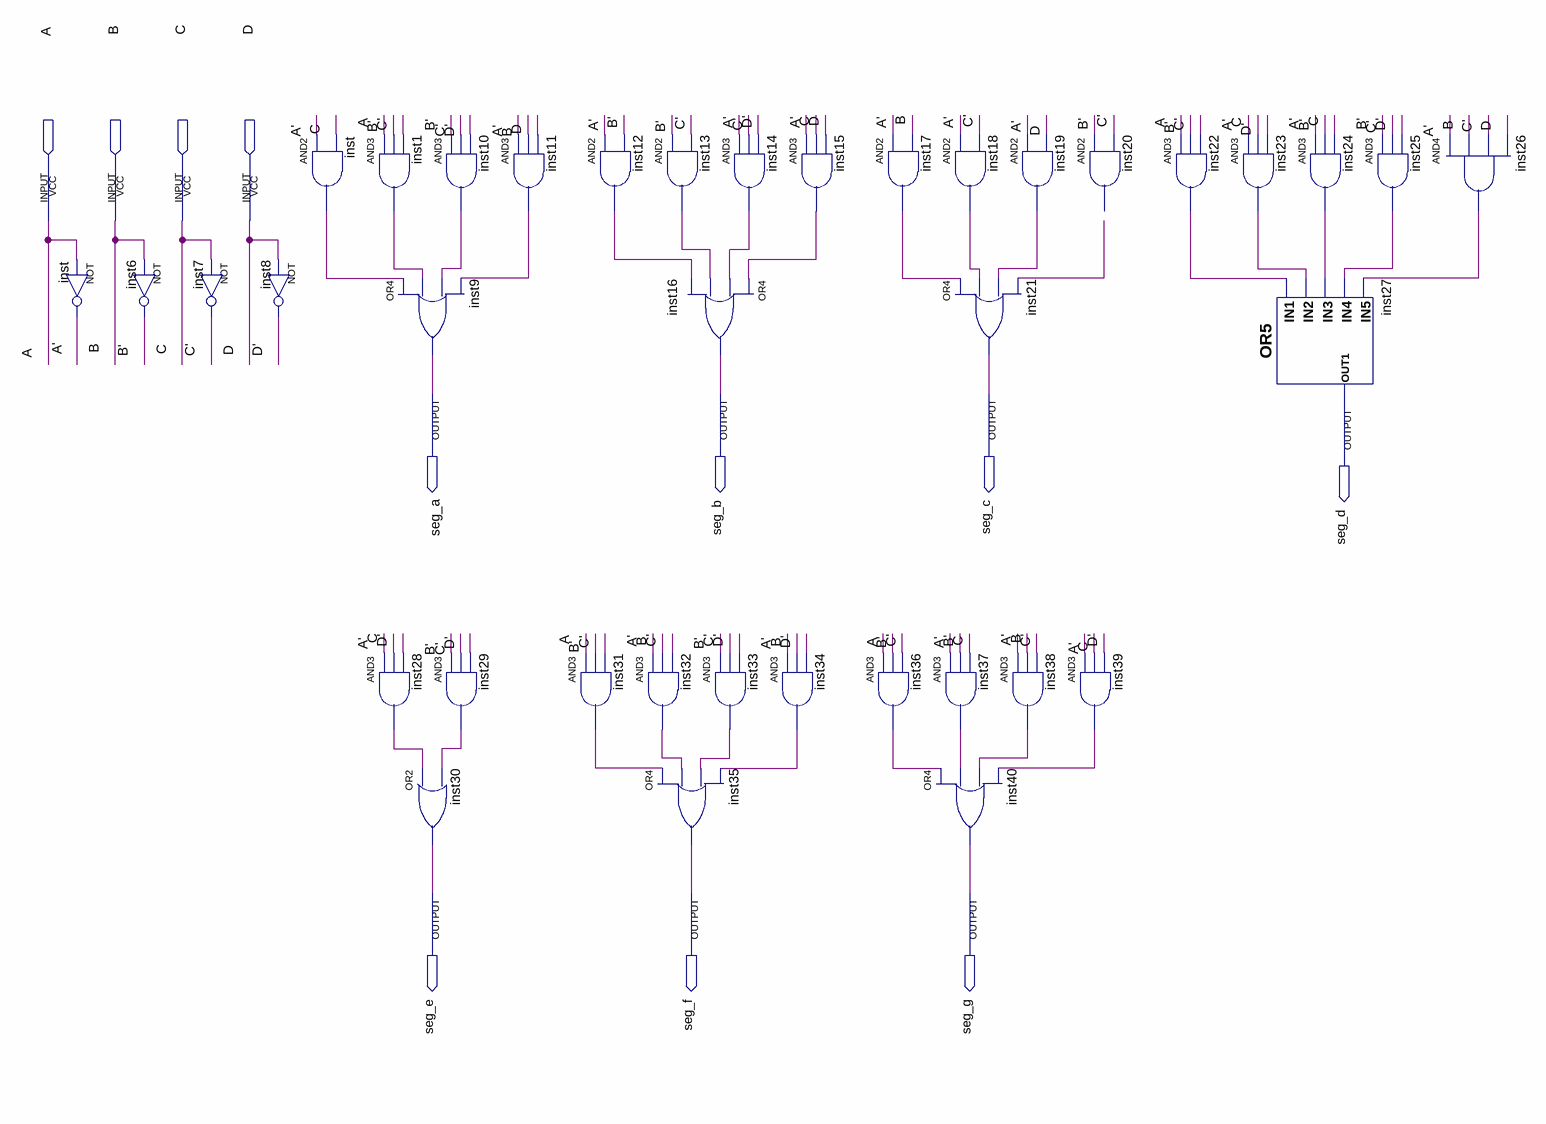
[diagram p0: schematic sheet]
// Quartus schematic BDC_catode.bdf as structural Verilog: 38 symbols, 11 pins
module BDC_catode (
  input  A,
  input  B,
  input  C,
  input  D,
  output seg_a,
  output seg_b,
  output seg_c,
  output seg_d,
  output seg_e,
  output seg_f,
  output seg_g
);

  wire \A' , \B' , \C' , \D' , inst1_out, inst10_out, inst11_out, inst12_out, inst13_out, inst14_out,
       inst15_out, inst17_out, inst18_out, inst19_out, inst22_out, inst23_out, inst24_out, inst25_out,
       inst26_out, inst28_out, inst29_out, inst31_out, inst32_out, inst33_out, inst34_out, inst36_out,
       inst37_out, inst38_out, inst39_out, inst_out, undriven;

  not inst (\A' , A);
  not inst6 (\B' , B);
  not inst7 (\C' , C);
  not inst8 (\D' , D);
  and inst_dup2 (inst_out, \A' , C);
  and inst1 (inst1_out, A, \B' , \C' );
  and inst10 (inst10_out, \B' , \C' , \D' );
  or inst9 (seg_a, inst_out, inst1_out, inst10_out, inst11_out);
  and inst28 (inst28_out, \A' , C, \D' );
  and inst29 (inst29_out, \B' , \C' , \D' );
  or inst30 (seg_e, inst28_out, inst29_out);
  and inst11 (inst11_out, \A' , B, D);
  and inst12 (inst12_out, \A' , \B' );
  and inst31 (inst31_out, A, \B' , \C' );
  and inst13 (inst13_out, \B' , \C' );
  and inst32 (inst32_out, \A' , B, \C' );
  or inst35 (seg_f, inst31_out, inst32_out, inst33_out, inst34_out);
  and inst14 (inst14_out, \A' , \C' , \D' );
  or inst16 (seg_b, inst15_out, inst14_out, inst13_out, inst12_out);
  and inst33 (inst33_out, \B' , \C' , \D' );
  and inst15 (inst15_out, \A' , C, D);
  and inst34 (inst34_out, \A' , B, \D' );
  and inst17 (inst17_out, \A' , B);
  and inst36 (inst36_out, A, \B' , \C' );
  and inst18 (inst18_out, \A' , \C' );
  or inst21 (seg_c, inst17_out, inst18_out, inst19_out, undriven);
  and inst37 (inst37_out, \A' , \B' , C);
  or inst40 (seg_g, inst36_out, inst37_out, inst38_out, inst39_out);
  and inst19 (inst19_out, \A' , D);
  and inst38 (inst38_out, \A' , B, \C' );
  // AND2 inst20 has open pins: IN1=\B' , IN2=\C' , OUT=open
  and inst39 (inst39_out, \A' , C, \D' );
  and inst22 (inst22_out, A, \B' , \C' );
  and inst23 (inst23_out, \A' , C, \D' );
  OR5 inst27 (.IN1(inst22_out), .IN3(inst24_out), .IN2(inst23_out), .IN5(inst26_out), .IN4(inst25_out), .OUT1(seg_d));
  and inst24 (inst24_out, \A' , \B' , C);
  and inst25 (inst25_out, \B' , \C' , \D' );
  and inst26 (inst26_out, \A' , B, \C' , D);
endmodule
